# EAGLE design ANISMADriverBoard_v03 (EAGLE 9.5.2)
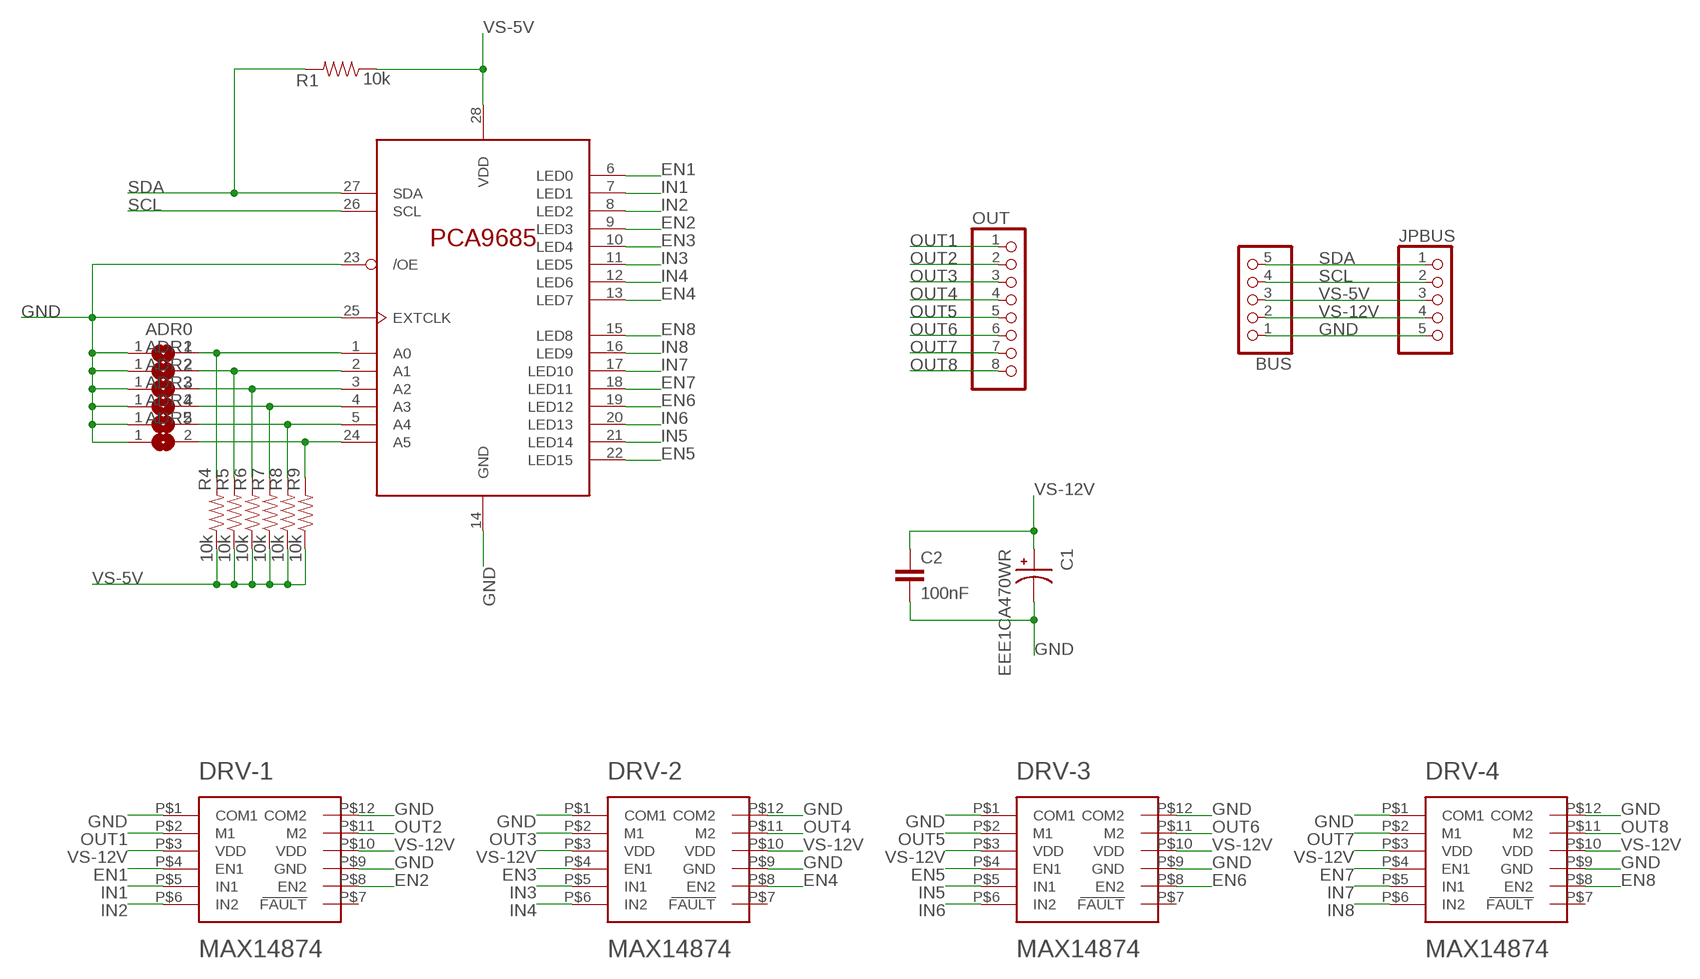
[diagram p0: schematic, sheet 1]

## Parts
ADR0  SJ  [SJ]
ADR1  SJ  [SJ]
ADR2  SJ  [SJ]
ADR3  SJ  [SJ]
ADR4  SJ  [SJ]
ADR5  SJ  [SJ]
BUS  PINHD-1X5/90  [1X05/90]
C1  EEE1CA470WR  [CAP_EEE1CA470WR]
C2  100nF  C-EUC0603  [C0603]
DRV-1  MAX14874  [TD1233]
DRV-2  MAX14874  [TD1233]
DRV-3  MAX14874  [TD1233]
DRV-4  MAX14874  [TD1233]
JPBUS  PINHD-1X5/90  [1X05/90]
OUT  PINHD-1X8/90  [1X08/90]
PCA9685  PCA9685PW  [TSSOP28]
R1  10k  10KOHM-0603-1/10W-1%  [0603]
R4  10k  10KOHM-0603-1/10W-1%  [0603]
R5  10k  10KOHM-0603-1/10W-1%  [0603]
R6  10k  10KOHM-0603-1/10W-1%  [0603]
R7  10k  10KOHM-0603-1/10W-1%  [0603]
R8  10k  10KOHM-0603-1/10W-1%  [0603]
R9  10k  10KOHM-0603-1/10W-1%  [0603]

## Nets
EN1: DRV-1.P$4(EN1) PCA9685.6(LED0)
EN2: DRV-1.P$8(EN2) PCA9685.9(LED3)
EN3: DRV-2.P$4(EN1) PCA9685.10(LED4)
EN4: DRV-2.P$8(EN2) PCA9685.13(LED7)
EN5: DRV-3.P$4(EN1) PCA9685.22(LED15)
EN6: DRV-3.P$8(EN2) PCA9685.19(LED12)
EN7: DRV-4.P$4(EN1) PCA9685.18(LED11)
EN8: DRV-4.P$8(EN2) PCA9685.15(LED8)
GND: ADR0.1 ADR1.1 ADR2.1 ADR3.1 ADR4.1 ADR5.1 BUS.1 C1.2 C2.2 DRV-1.P$1(COM1) DRV-1.P$9(GND) DRV-1.P$12(COM2) DRV-2.P$1(COM1) DRV-2.P$9(GND) DRV-2.P$12(COM2) DRV-3.P$1(COM1) DRV-3.P$9(GND) DRV-3.P$12(COM2) DRV-4.P$1(COM1) DRV-4.P$9(GND) DRV-4.P$12(COM2) JPBUS.5 PCA9685.14(GND) PCA9685.23(/OE) PCA9685.25(EXTCLK)
IN1: DRV-1.P$5(IN1) PCA9685.7(LED1)
IN2: DRV-1.P$6(IN2) PCA9685.8(LED2)
IN3: DRV-2.P$5(IN1) PCA9685.11(LED5)
IN4: DRV-2.P$6(IN2) PCA9685.12(LED6)
IN5: DRV-3.P$5(IN1) PCA9685.21(LED14)
IN6: DRV-3.P$6(IN2) PCA9685.20(LED13)
IN7: DRV-4.P$5(IN1) PCA9685.17(LED10)
IN8: DRV-4.P$6(IN2) PCA9685.16(LED9)
N$3: ADR0.2 PCA9685.1(A0) R4.2
N$4: ADR1.2 PCA9685.2(A1) R5.2
N$5: ADR2.2 PCA9685.3(A2) R6.2
N$6: ADR3.2 PCA9685.4(A3) R7.2
N$7: ADR4.2 PCA9685.5(A4) R8.2
N$8: ADR5.2 PCA9685.24(A5) R9.2
OUT1: DRV-1.P$2(M1) OUT.1
OUT2: DRV-1.P$11(M2) OUT.2
OUT3: DRV-2.P$2(M1) OUT.3
OUT4: DRV-2.P$11(M2) OUT.4
OUT5: DRV-3.P$2(M1) OUT.5
OUT6: DRV-3.P$11(M2) OUT.6
OUT7: DRV-4.P$2(M1) OUT.7
OUT8: DRV-4.P$11(M2) OUT.8
SCL: BUS.4 JPBUS.2 PCA9685.26(SCL)
SDA: BUS.5 JPBUS.1 PCA9685.27(SDA) R1.2
VS-5V: BUS.3 JPBUS.3 PCA9685.28(VDD) R1.1 R4.1 R5.1 R6.1 R7.1 R8.1 R9.1
VS-12V: BUS.2 C1.1 C2.1 DRV-1.P$3(VDD) DRV-1.P$10(VDD) DRV-2.P$3(VDD) DRV-2.P$10(VDD) DRV-3.P$3(VDD) DRV-3.P$10(VDD) DRV-4.P$3(VDD) DRV-4.P$10(VDD) JPBUS.4
Unconnected: DRV-1.P$7(FAULT) DRV-2.P$7(FAULT) DRV-3.P$7(FAULT) DRV-4.P$7(FAULT)

## Library data of the parts
ADR0 ADR1-ADR5 = jumper:SJ: SMD solder JUMPER
BUS JPBUS = pinhead:PINHD-1X5: PIN HEADER
C1 = EEE1CA470WR:EEE1CA470WR: Check prices <https://pricing.snapeda.com/parts/EEE-1CA470WR/Panasonic%20Electronic/view-part?ref=eda>; AVAILABILITY: In Stock; DESCRIPTION: 47µF 16V Aluminum Electrolytic Capacitors Radial, Can - SMD 1000 Hrs @ 85°C; MF: Panasonic Electronic; MP: EEE-1CA470WR; PACKAGE: RADIAL-2 Panasonic; PRICE: None; PURCHASE-URL: https://pricing.snapeda.com/search/part/EEE-1CA470WR/?ref=eda
C2 = rcl:C-EU: CAPACITOR, European symbol; SPICEPREFIX: C
DRV-1-DRV-4 = Mo Custom Components:MAX14874
OUT = pinhead:PINHD-1X8: PIN HEADER
PCA9685 = i2c-led-controller:PCA9685
R1 R4-R9 = SparkFun-Resistors:10KOHM: 10kΩ resistor A resistor is a passive two-terminal electrical component that implements electrical resistance as a circuit element. Resistors act to reduce current flow, and, at the same time, act to lower voltage levels within circuits. - Wikipedia; PROD_ID: RES-00824; SPICEPREFIX: R

## Board
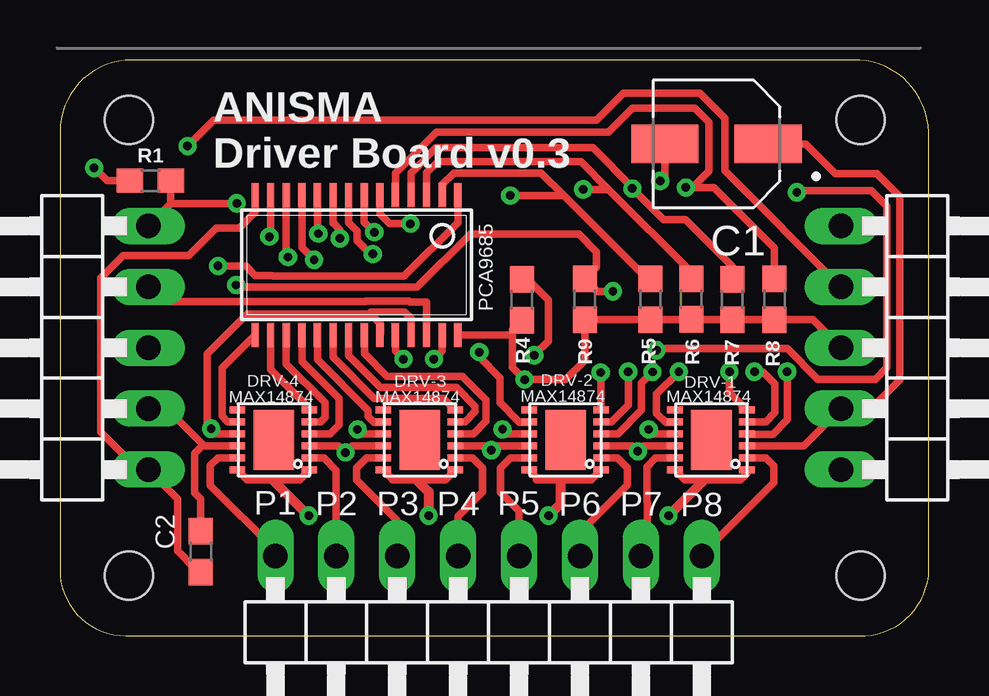
[diagram p1: board, top side]
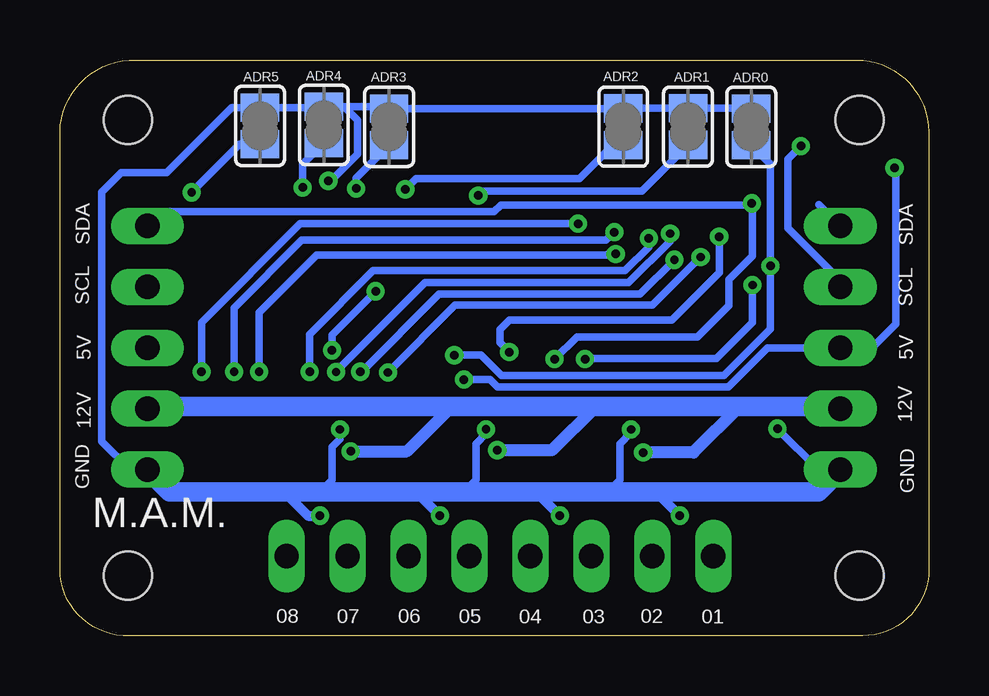
[diagram p2: board, bottom side, seen from below]

Size 36.21 x 24.02 mm. Coordinates in mm from the lower left corner, seen from the top.
Outline: 36.21,2.52 36.21,21.02 arc90 33.05,24.02 3,24.02 arc90 0,21.02 0,2.52 arc90 3,0.02 33.05,0.02 arc90 36.21,2.52
Copper layers (1*16): Top 0.035mm / dielectric 1.5mm / Bottom 0.035mm
Design rules "default *": minimum track width 6mil, minimum drill 0.35mm, track to track 6mil, track to pad 6mil, pad to pad 6mil, via to via 6mil, smd to smd 6mil, copper to edge 40mil, drill to drill 6mil, minimum pad ring 10mil, minimum via ring 8mil, stop-mask expansion 4mil, vias tented up to drill 0.5mm, thermal gap 10mil
Holes 2 mm at 2.87,21.52 2.87,2.52 33.37,2.52 33.37,21.52

### Footprints (pad centres in the part's own frame; a part is rotated, then mirrored left to right if it is on the bottom)
SJ = smd 1.168 x 1.6: 1 -0.762,0; 2 0.762,0
1X05/90 = drill 1.016 long: 1 -5.08,-3.81; 2 -2.54,-3.81; 3 0,-3.81; 4 2.54,-3.81; 5 5.08,-3.81
CAP_EEE1CA470WR = smd 2.8 x 1.6: 1 -2.15,0; 2 2.15,0
C0603 = smd 1.1 x 1: 1 -0.85,0; 2 0.85,0
TD1233 = smd 0.65 x 0.3: P$1 -1.475,1.25; P$2 -1.475,0.75; P$3 -1.475,0.25; P$4 -1.475,-0.25; P$5 -1.475,-0.75; P$6 -1.475,-1.25; P$7 1.525,-1.25; P$8 1.525,-0.75; P$9 1.525,-0.25; P$10 1.525,0.25; P$11 1.525,0.75; P$12 1.525,1.25 | smd 1.7 x 2.5: P$13 0,0
1X08/90 = drill 1.016 long: 1 -8.89,-3.81; 2 -6.35,-3.81; 3 -3.81,-3.81; 4 -1.27,-3.81; 5 1.27,-3.81; 6 3.81,-3.81; 7 6.35,-3.81; 8 8.89,-3.81
TSSOP28 = smd 0.305 x 0.991: 1 -4.225,-2.918; 2 -3.575,-2.918; 3 -2.925,-2.918; 4 -2.275,-2.918; 5 -1.625,-2.918; 6 -0.975,-2.918; 7 -0.325,-2.918; 8 0.325,-2.918; 9 0.975,-2.918; 10 1.625,-2.918; 11 2.275,-2.918; 12 2.925,-2.918; 13 3.575,-2.918; 14 4.225,-2.918; 15 4.225,2.918; 16 3.575,2.918; 17 2.925,2.918; 18 2.275,2.918; 19 1.625,2.918; 20 0.975,2.918; 21 0.325,2.918; 22 -0.325,2.918; 23 -0.975,2.918; 24 -1.625,2.918; 25 -2.275,2.918; 26 -2.925,2.918; 27 -3.575,2.918; 28 -4.225,2.918
0603 = smd 1.1 x 1: 1 -0.85,0; 2 0.85,0

### Placement (x,y rotation side)
ADR0  7.39,21.23 270 bottom
ADR1  10.03,21.24 270 bottom
ADR2  12.73,21.24 270 bottom
ADR3  22.49,21.23 270 bottom
ADR4  25.21,21.31 270 bottom
ADR5  27.87,21.27 270 bottom
BUS  -0.13,12.02 90 top
C1  27.37,20.52 180 top
C2  5.87,3.52 270 top
DRV-1  27.16,8.18 180 top
DRV-2  21.08,8.18 180 top
DRV-3  15,8.18 180 top
DRV-4  8.92,8.18 180 top
JPBUS  36.37,12.02 270 top
OUT  17.87,-0.48 180 top
PCA9685  12.36,15.47 180 top
R1  3.77,18.98 0 top
R4  19.25,14.02 90 top
R5  24.62,14.04 90 top
R6  26.32,14.05 90 top
R7  28.03,14.03 90 top
R8  29.79,14.04 90 top
R9  21.88,14.04 90 top

### Tracks (layer width: path | path; a pad name or v marks a point on that pad's centre or on a via)
EN1  (via drill 0.35)
  Top 0.305: DRV-1.P$4 28.65,8.41 29.71,8.41 30.32,9.03 30.32,10.66 30.31,10.66 v30.31,11.02 | PCA9685.6 13.34,17.59 13.74,17.19 v14.61,17.19
  Bottom 0.305: v14.61,17.19 26.2,17.19 30.31,13.08 v30.31,11.02
EN2  (via drill 0.35)
  Top 0.305: DRV-1.P$8 25.6,8.89 25.26,8.89 24.87,9.29 24.87,10.09 v25.8,11.02 | PCA9685.9 11.39,17.21 11.4,17.22 11.66,16.95 v11.66,16.58
  Bottom 0.305: v11.66,16.58 11.66,16.22 12.65,15.24 23.15,15.24 25.81,12.58 25.81,10.97 25.8,10.98 v25.8,11.02
EN3  (via drill 0.35)
  Top 0.305: DRV-2.P$4 23.25,8.43 24.24,9.42 24.24,10.55 v24.7,11.01 | PCA9685.10 10.73,16.82 v10.77,16.78
  Bottom 0.305: v10.77,16.78 10.77,16.47 12.51,14.73 21,14.73 24.61,11.12 24.61,11.1 v24.7,11.01
EN4  (via drill 0.35)
  Top 0.305: DRV-2.P$8 19.54,8.91 19.16,8.91 18.35,9.73 18.35,10.77 17.48,11.64 v17.48,11.84 | PCA9685.13 8.79,16.7 v8.73,16.65
  Bottom 0.305: v8.73,16.65 8.73,15.16 10.71,13.18 17.48,13.18 17.87,12.79 17.87,12.23 v17.48,11.84
EN5
  Top 0.305: DRV-3.P$4 17.24,8.43 17.77,8.96 17.77,9.84 16.79,10.82 13.65,10.82 12.69,11.78 PCA9685.22
EN6
  Top 0.305: DRV-3.P$8 13.46,8.91 13.08,8.91 12.84,9.15 12.84,9.41 10.73,11.52 PCA9685.19
EN7
  Top 0.305: DRV-4.P$4 11.25,8.43 11.63,8.8 11.63,9.9 10.09,11.44 PCA9685.18
EN8
  Top 0.305: DRV-4.P$8 6.98,8.93 6.75,9.17 6.75,11.17 PCA9685.15
GND  (via drill 0.35)
  Top 0.305: DRV-4.P$1 9.98,6.52 8.87,6.52 7.81,6.52 DRV-4.P$12 | DRV-3.P$12 13.87,6.53 13.87,6.52 14.87,6.52 16.07,6.52 DRV-3.P$1 | DRV-2.P$12 19.87,6.61 19.87,6.52 20.87,6.52 22.14,6.52 DRV-2.P$1 | DRV-1.P$12 26.05,6.52 26.87,6.52 28.37,6.52 28.64,6.78 DRV-1.P$1 | DRV-3.P$9 12.4,8.43 v12.4,8.61 | DRV-4.P$9 6.41,8.43 6.3,8.54 v6.3,8.64 6.13,8.81 6.13,11.76 7.8,13.43 12.87,13.43 | DRV-2.P$9 19.55,8.42 18.67,8.42 18.47,8.62 v18.45,8.62 | DRV-1.P$9 24.72,8.43 v24.54,8.61 | 12.87,13.43 12.96,13.43 13.37,13.02 13.37,12.59 PCA9685.23 | PCA9685.25 14.64,13.25 14.37,13.52 12.96,13.52 12.87,13.43 | PCA9685.14 8.14,17.68 7.48,17.02 6.52,17.02 5.37,15.87 2.64,15.87 1.7,14.93 1.7,8.51 3.27,6.94 BUS.1 4.9,5.72 4.9,3.55 5.66,2.79 5.75,2.79 C2.2 | C1.2 25.22,19.18 v25.02,18.98
  Top 0.406: 8.87,6.52 v10.37,5.02 | 14.87,6.52 15.37,6.02 v15.37,5.02 | 20.87,6.52 20.87,5.52 v20.37,5.02 | v25.37,5.02 26.87,6.52
  Bottom 0.305: 16.37,6.02 16.87,6.02 | 21.37,6.02 21.87,6.02 | v12.4,8.61 12.4,8.48 12.87,8.02 12.87,6.52 13.37,6.02 | v6.3,8.64 4.6,6.94 BUS.1 | v18.45,8.62 18.45,8.44 18.87,8.02 18.87,6.52 19.37,6.02 | v24.54,8.61 24.54,8.21 24.87,7.88 24.87,6.52 25.37,6.02 | ADR0.1 7.4,22 ADR1.1 ADR2.1 ADR3.1 22.57,22.07 24.37,22.07 | 24.37,22.07 ADR4.1 25.25,22.03 ADR5.1 29.05,22.03 31.76,19.32 33.66,19.32 34.47,18.51 34.47,8.12 33.29,6.94 JPBUS.5 | v25.02,18.98 24.91,18.98 23.8,20.09 23.8,21.5 24.37,22.07
  Bottom 0.406: v10.37,5.02 11.37,6.02 | v15.37,5.02 16.37,6.02 | v20.37,5.02 21.37,6.02 | 26.87,6.02 25.87,5.02 v25.37,5.02
  Bottom 0.813: BUS.1 4.6,6.02 11.37,6.02 13.37,6.02 16.87,6.02 19.37,6.02 21.87,6.02 25.37,6.02 26.87,6.02 31.64,6.02 JPBUS.5
IN1  (via drill 0.35)
  Top 0.305: DRV-1.P$5 29.42,8.93 29.81,9.32 29.81,10.52 29.31,11.02 v28.95,11.02 | PCA9685.7 12.68,17.25 v13.1,16.84
  Bottom 0.305: v13.1,16.84 13.44,16.5 26.13,16.5 28.95,13.68 v28.95,11.02
IN2  (via drill 0.35)
  Top 0.305: PCA9685.8 12.04,17.24 12.38,16.89 12.38,16.5 12.94,15.93 v13.04,15.93 | v27.91,11.02 27.91,10.15 DRV-1.P$6
  Bottom 0.305: v13.04,15.93 13.36,15.93 13.41,15.88 20.87,15.88 25.51,15.88 27.91,13.48 v27.91,11.02
IN3  (via drill 0.35)
  Top 0.305: DRV-2.P$5 22.99,8.93 23.7,9.64 23.7,11 v23.69,11.02 | PCA9685.11 10.09,16.19 v10.59,15.68
  Bottom 0.305: v10.59,15.68 12.03,14.25 20.4,14.25 23.63,11.02 v23.69,11.02
IN4  (via drill 0.35)
  Top 0.305: PCA9685.12 9.43,15.87 v9.5,15.8 | v22.54,10.99 22.55,10.97 DRV-2.P$6
  Bottom 0.305: v9.5,15.8 v9.51,15.8 11.52,13.79 19.74,13.79 v22.54,10.99
IN5
  Top 0.305: PCA9685.21 12.04,11.7 13.37,10.37 16.52,10.37 17.31,9.58 17.31,9.36 16.88,8.93 DRV-3.P$5
IN6
  Top 0.305: PCA9685.20 11.39,11.62 13.1,9.91 16,9.91 DRV-3.P$6
IN7
  Top 0.305: DRV-4.P$5 10.87,8.93 11.05,9.11 11.05,9.73 9.43,11.34 PCA9685.17
IN8
  Top 0.305: PCA9685.16 8.79,11.11 10.39,9.5 DRV-4.P$6
N$3  (via drill 0.35)
  Top 0.305: PCA9685.1 16.59,17.23 14.35,15 8.89,15 8.85,15.03 8.14,15.03 7.75,15.43 v6.59,15.43 | v19.77,11.71 20.37,12.31 20.37,14.02 19.52,14.87 R4.2
  Bottom 0.305: v19.77,11.71 18.65,11.71 17.8,10.86 8.53,10.86 6.59,12.8 v6.59,15.43 6.59,19.67 ADR0.2 7.37,20.49 7.37,22.02
N$4  (via drill 0.35)
  Top 0.305: R5.2 24.48,14.89 21,18.37 | 21,18.37 20.06,19.31 16.43,19.31 15.94,18.82 PCA9685.2 | v18.77,18.37 21,18.37
  Bottom 0.305: v18.77,18.37 18.59,18.55 11.96,18.55 ADR1.2 10.03,21.68 10.37,22.02
N$5  (via drill 0.35)
  Top 0.305: R6.2 26.32,15.17 22.87,18.62 | 22.87,18.62 21.71,19.78 15.75,19.78 15.29,19.31 PCA9685.3 | v21.81,18.62 22.87,18.62
  Bottom 0.305: v21.81,18.62 21.36,19.08 14.56,19.08 13.17,20.47 ADR2.2 12.73,21.86
N$6  (via drill 0.35)
  Top 0.305: R7.2 28.03,15.41 26.07,17.37 25.37,17.37 25.25,17.37 25.15,17.37 v23.86,18.66 23.89,18.68 22.21,20.36 15.68,20.36 14.64,19.31 PCA9685.4
  Bottom 0.305: v23.86,18.66 23.86,19.1 ADR3.2 22.49,21.91 22.51,21.93
N$7  (via drill 0.35)
  Top 0.305: R8.2 29.79,16.18 27.27,18.7 26.37,18.7 | PCA9685.5 13.98,19.31 15.7,21.02 22.87,21.02 23.87,22.02 26.46,22.02 27.06,21.42 27.06,19.39 26.37,18.7 | v26.09,18.7 26.37,18.7
  Bottom 0.305: v26.09,18.7 26.09,19.67 ADR4.2 25.21,22.02 25.24,22.05
N$8  (via drill 0.35)
  Top 0.305: PCA9685.24 13.98,11.88 v14.32,11.55 | v7.34,14.63 7.43,14.54 14.89,14.54 17.11,16.76 21.63,16.76 22.37,16.02 22.37,15.38 R9.2 22.4,14.37 v23.05,14.37 | v24.87,11.92 24.93,11.98 30.32,11.98 31.6,10.7 33.98,10.7 34.47,11.19 34.47,17.93 33.82,18.58 30.8,18.58 v30.72,18.5
  Bottom 0.305: v14.32,11.55 14.3,11.57 8.84,11.57 7.34,13.07 v7.34,14.63 | v23.05,14.37 24.87,12.55 v24.87,11.92 | v30.72,18.5 28.71,20.51 ADR5.2 27.87,22.01 27.86,22.02
OUT1
  Top 0.305: DRV-1.P$2 29.43,7.43 29.76,7.1 29.76,6.4 26.76,3.4 OUT.1
OUT2
  Top 0.305: DRV-1.P$11 24.83,7.43 24.46,7.06 24.46,5.6 24.48,5.58 24.48,3.59 OUT.2
OUT3
  Top 0.305: DRV-2.P$2 23.24,7.43 23.66,7.01 23.66,6.3 21.68,4.32 OUT.3
OUT4
  Top 0.305: DRV-2.P$11 18.78,7.43 18.37,7.02 18.37,5.99 19.14,5.22 OUT.4
OUT5
  Top 0.305: DRV-3.P$2 17.19,7.43 17.62,7 17.62,6.01 16.6,4.99 OUT.5
OUT6
  Top 0.305: DRV-3.P$11 12.78,7.43 12.37,7.02 12.37,6.52 14.06,4.83 OUT.6
OUT7
  Top 0.305: DRV-4.P$2 11,7.43 11.52,6.91 OUT.7
OUT8
  Top 0.305: DRV-4.P$11 6.59,7.43 6.27,7.11 6.27,6.29 8.98,3.58 OUT.8
SCL  (via drill 0.35)
  Top 0.305: PCA9685.26 15.29,13.93 14.6,13.93 14.56,13.98 12.77,13.98 12.74,13.95 4.29,13.95 BUS.4 | v5.32,20.43 6.41,21.52 22.37,21.52 23.49,22.64 26.67,22.64 27.72,21.59 27.71,21.58 27.71,19.41 JPBUS.2
  Bottom 0.305: v5.32,20.43 5.87,19.88 5.87,17.02 3.68,14.83 BUS.4
SDA  (via drill 0.35)
  Top 0.305: PCA9685.27 15.94,11.89 v15.59,11.54 | v7.37,18.04 4.62,18.04 | BUS.5 4.49,17.9 4.62,18.04 | R1.2 4.62,18.04
  Bottom 0.305: v15.59,11.54 14.66,12.47 9.63,12.47 8.32,13.78 8.32,14.86 7.34,15.84 7.34,18.04 v7.37,18.04 7.45,17.96 17.83,17.96 18.11,17.69 31.97,17.69 JPBUS.1 | 4.57,17.99 BUS.5
VS-5V  (via drill 0.35)
  Top 0.305: 18.87,12.55 PCA9685.28 | R4.1 18.87,12.79 18.87,12.55 | 18.87,12.55 18.87,11.19 v19.37,10.69 21.08,10.69 21.88,11.49 R9.1 R5.1 R6.1 28.01,13.2 R7.1 R8.1 31.39,13.19 JPBUS.3 | v1.42,19.52 1.96,18.98 R1.1
  Bottom 0.305: v19.37,10.69 18.28,10.69 17.98,10.39 8.35,10.39 6.72,12.02 BUS.3 2.37,12.02 1.37,13.02 1.37,19.47 v1.42,19.52
VS-12V  (via drill 0.35)
  Top 0.305: DRV-4.P$3 11.62,7.93 v11.9,7.65 12.18,7.93 DRV-3.P$10 | DRV-3.P$3 17.8,7.93 v17.98,7.75 18.16,7.93 DRV-2.P$10 | DRV-2.P$3 23.86,7.93 v24.09,7.7 24.32,7.93 DRV-1.P$10 | DRV-4.P$10 6,7.93 5.96,7.97 | BUS.2 4.45,9.48 5.96,7.97 | DRV-1.P$3 31.01,7.93 JPBUS.4 33.83,9.48 35.02,10.67 35.02,18.32 34.05,19.29 32.33,19.29 31.1,20.52 C1.1 | C2.1 5.87,5.71 5.61,5.97 5.61,7.62 5.96,7.97
  Bottom 0.508: 7.87,9.58 9.8,7.65 v11.9,7.65 | 13.87,9.58 15.7,7.75 v17.98,7.75 | 19.87,9.58 21.75,7.7 v24.09,7.7
  Bottom 0.813: BUS.2 3.78,9.58 7.87,9.58 13.87,9.58 19.87,9.58 32.46,9.58 JPBUS.4

### Text on the board
tNames: ANISMA / Driver Board v0.3 | P1 | P5 | P2 | P3 | P4 | P6 | P7 | P8
bNames: SDA | SDA | SCL | SCL | 5V | 5V | 12V | 12V | GND | GND | M.A.M. | 01 | 02 | 03 | 04 | 05 | 06 | 07 | 08